# Altium schematic sheet temp-sensor-interface-hw.SchDoc
size A3; Date: 03/03/2023; SheetNumber: 10; SheetTotal: 10; Group: CoP
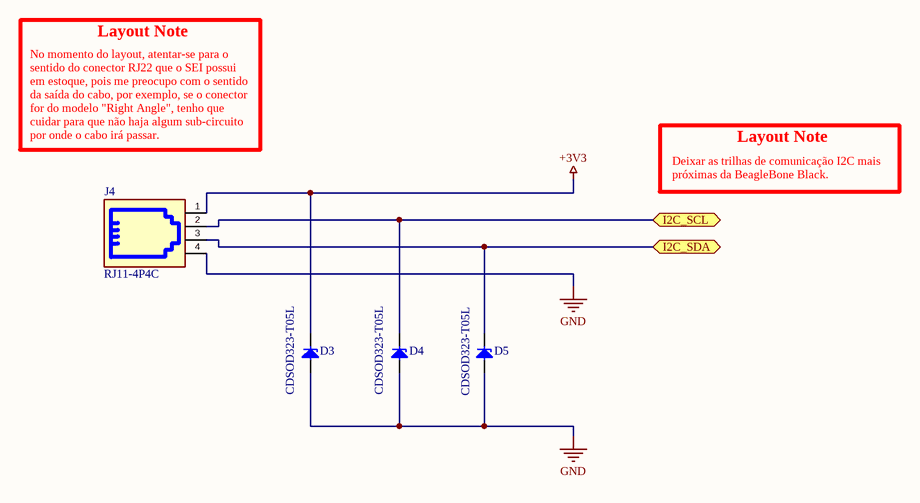
[diagram p0: temp-sensor-interface-hw.SchDoc]

## Parts
D3  CDSOD323-T05L  [SOD-323]
D4  CDSOD323-T05L  [SOD-323]
D5  CDSOD323-T05L  [SOD-323]
J4  RJ11-4P4C  [YH55-01]

## Ports
I2C_SCL (bidir, see beaglebone-interface-hw[6A]), I2C_SDA (bidir, see beaglebone-interface-hw[7A])

## Nets
+3V3: D3.1 J4.1
GND: D3.2 D4.2 D5.2 J4.4
I2C_SCL: D4.1 J4.2 ; port I2C_SCL
I2C_SDA: D5.1 J4.3 ; port I2C_SDA

## Notes on the sheet
- Layout Note
- No momento do layout, atentar-se para o sentido do conector RJ22 que o SEI possui em estoque, pois me preocupo com o sentido da saída do cabo, por exemplo, se o conector for do modelo "Right Angle", tenho que cuidar para que não haja algum sub-circuito por onde o cabo irá passar.
- Deixar as trilhas de comunicação I2C mais próximas da BeagleBone Black.
- Title:
- Date:
- Project:
- Drawn by:
- Time:
- Revision:
- Sheet
- of
- ENT - AIS - SEI
  Sistemas Eletrônicos e
  Instrumentação
- Copyright CNPEM 2023.
  This documentation describes Open Hardware and is licensed under the CERN OHL S v2. You may redistribute and modify this documentation under the terms of the CERN OHL S v2. (https://www.ohwr.org/cernohl). This documentation is distributed WITHOUT ANY EXPRESS OR IMPLIED WARRANTY, INCLUDING OF MERCHANTABILITY, SATISFACTORY QUALITY AND FITNESS FOR A PARTICULAR PURPOSE. Please see the CERN OHL S v2 for applicable conditions.
- File:

## Library data of the parts
D3-D5 = CDSOD323-T05L: Unidirectional TVS Diode; Supplier 1: Avnet; Supplier Part Number 1: CDSOD323-T05L
J4 = RJ11: MC114268 JACK RJ11 4P4C PARA PLACA 14.5X10X12MM, CODIGO YH55-01, DAIER